# Altium project AX5043_module.PrjPcb
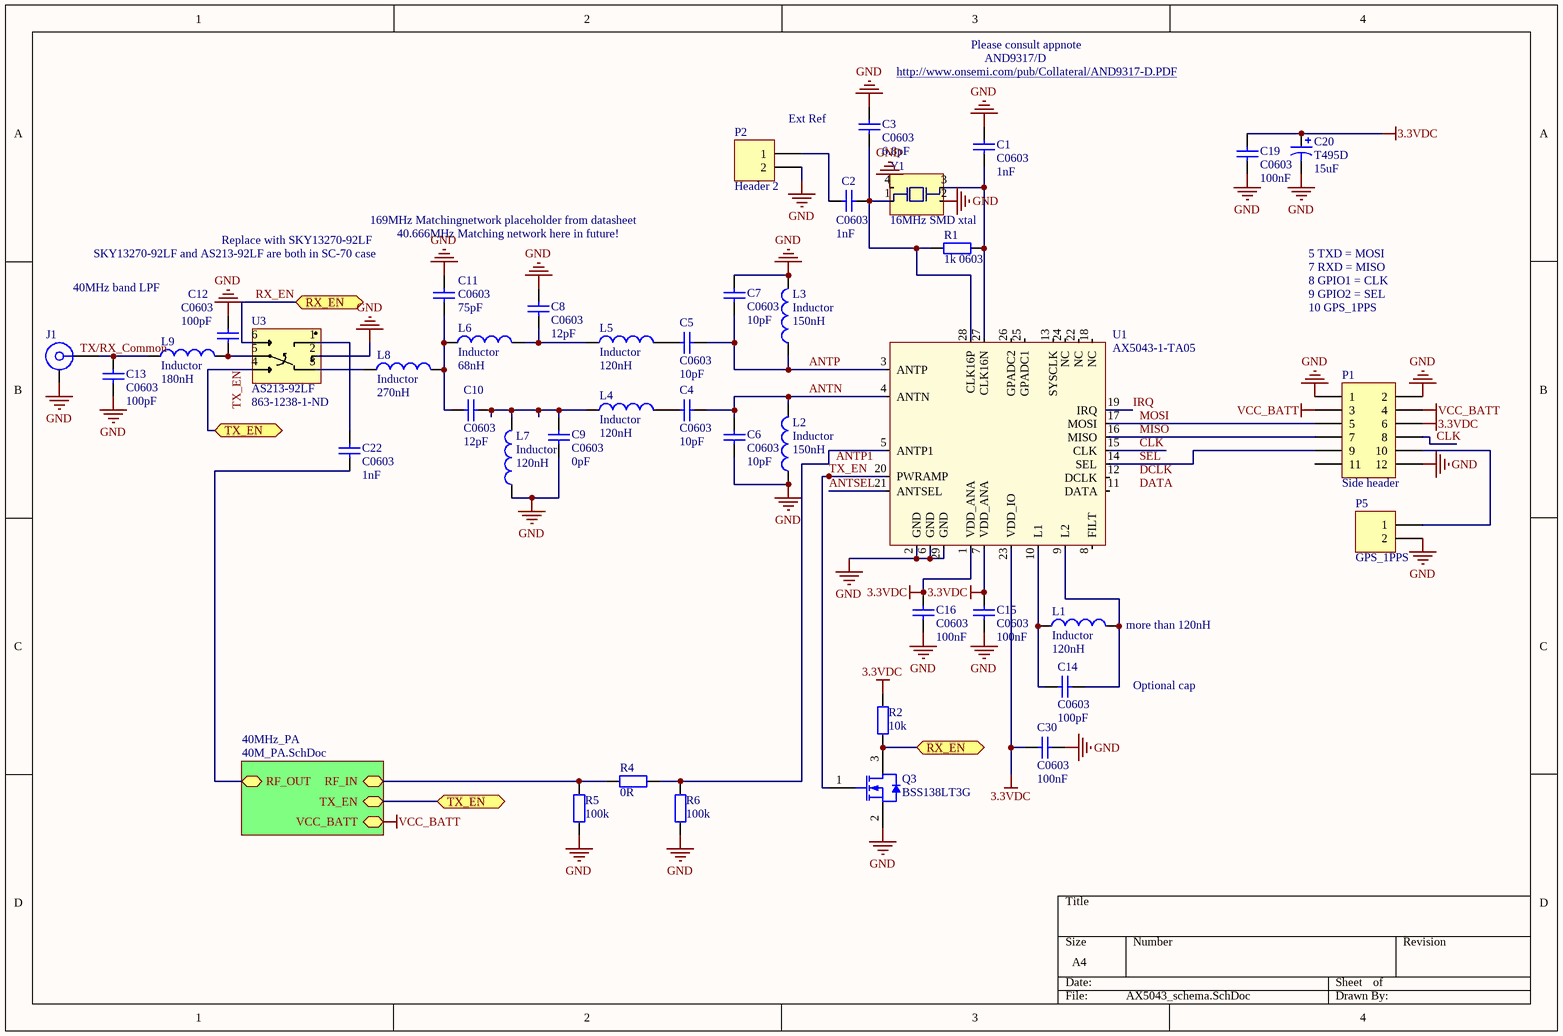
[diagram p0: AX5043_schema.SchDoc]
2 sheets, 59 parts. Net scope: hierarchical (ports join the sheet entries above them; power ports are global).
Board file: AX5043_module_pcb.PcbDoc
Sheets:
  AX5043_schema.SchDoc
    40MHz_PA = 40M_PA.SchDoc

## Sheet AX5043_schema.SchDoc: AX5243 40MHz Module
size A4; Date: 24.10.2017; DrawnBy: iv; Organization: FTG Heavy Industries; Revision: 0; SheetNumber: 1; SheetTotal: 1; DocumentName: AX5243 40MHz transceiver module main sheet; ProjectName: AX5243Module

### Parts
C1  C0603  value 1nF  [0603]
C2  C0603  value 1nF  [0603]
C3  C0603  value 6.8pF  [0603]
C4  C0603  value 10pF  [0603]
C5  C0603  value 10pF  [0603]
C6  C0603  value 10pF  [0603]
C7  C0603  value 10pF  [0603]
C8  C0603  value 12pF  [0603]
C9  C0603  value 0pF  [0603]
C10  C0603  value 12pF  [0603]
C11  C0603  value 75pF  [0603]
C12  C0603  value 100pF  [0603]
C13  C0603  value 100pF  [0603]
C14  C0603  value 100pF  [0603]
C15  C0603  value 100nF  [0603]
C16  C0603  value 100nF  [0603]
C19  C0603  value 100nF  [0603]
C20  T495D  value 15uF  [D]
C22  C0603  value 1nF  [0603]
C30  C0603  value 100nF  [0603]
J1  32K145-400L5  [ROS-32K145-400L5_V]  (value not drawn)
L1  Inductor  value 120nH  [INDC1608L]
L2  Inductor  value 150nH  [INDC1608L]
L3  Inductor  value 150nH  [INDC1608L]
L4  Inductor  value 120nH  [INDC1608L]
L5  Inductor  value 120nH  [INDC1608L]
L6  Inductor  value 68nH  [INDC1608L]
L7  Inductor  value 120nH  [INDC1608L]
L8  Inductor  value 270nH  [INDC1608L]
L9  Inductor  value 180nH  [INDC1608L]
P1  Side header  [HDR2X6H]
P2  Header 2  [HDR1X2]
P5  GPS_1PPS  [HDR1X2]
Q3  BSS138LT3G  [ONSC-SOT-23-3-318-08_V]
R1  1k 0603  [R0603]
R2  10k  [R0603]
R4  0R  [R0603]
R5  100k  [R0603]
R6  100k  [R0603]
U1  AX5043-1-TA05  [QFN50P500X500X85_HS-29M]
U3  AS213-92LF  Supplier Part Number 1: 863-1238-1-ND  [SC70_6]
Y1  16MHz SMD xtal  [FA-238]

### Sub-sheets
40MHz_PA = 40M_PA.SchDoc: RF_IN, RF_OUT, TX_EN, VCC_BATT

### Ports
RX_EN, TX_EN

### Nets
3.3VDC: C15.2 C16.2 C19.2 C20.1 C30.1 P1.6 R2.2 U1.1(VDD_ANA) U1.7(VDD_ANA) U1.23(VDD_IO)
GND: C1.2 C3.2 C6.1 C7.2 C8.1 C9.2 C11.1 C12.1 C13.1 C15.1 C16.1 C19.1 C20.2 C30.2 J1.MP L2.1 L3.2 L7.1 P1.1 P1.2 P1.12 P2.2 P5.2 Q3.2(S) R5.1 R6.1 U1.2(GND) U1.6(GND) U1.29(GND) U3.2 Y1.2 Y1.4
VCC_BATT: P1.3 P1.4 ; sheet 40MHz_PA/VCC_BATT
ANTN: C4.2 C6.2 L2.2 U1.4(ANTN)
ANTP: C5.2 C7.1 L3.1 U1.3(ANTP)
ANTSEL: U1.21(ANTSEL)
CLK: P1.8 U1.15(CLK)
IRQ: U1.19(IRQ)
MISO: P1.7 U1.16(MISO)
MOSI: P1.5 U1.17(MOSI)
RX_EN: Q3.3(D) R2.1 U3.6 ; port RX_EN
SEL: P1.9 U1.14(SEL)
TX_EN: Q3.1(G) U1.20(PWRAMP) U3.4 ; port TX_EN, sheet 40MHz_PA/TX_EN
NetC1_1: C1.1 R1.2 U1.27(CLK16N) Y1.3
NetC2_1: C2.1 C3.1 R1.1 U1.28(CLK16P) Y1.1
NetC2_2: C2.2 P2.1
NetC4_1: C4.1 L4.2
NetC5_1: C5.1 L5.2
NetC8_2: C8.2 L5.1 L6.2
NetC9_1: C9.1 C10.2 L4.1 L7.2
NetC10_1: C10.1 C11.2 L6.1 L8.2
NetC12_2: C12.2 L9.2 U3.5
NetC13_2: C13.2 J1.1 L9.1
NetC14_1: C14.1 L1.1 U1.10(L1)
NetC14_2: C14.2 L1.2 U1.9(L2)
NetC22_1: C22.1 ; sheet 40MHz_PA/RF_OUT
NetC22_2: C22.2 U3.1
NetC23_2: R4.2 R5.2 ; sheet 40MHz_PA/RF_IN
NetL8_1: L8.1 U3.3
NetP1_10: P1.10 P5.1
NetR4_1: R4.1 R6.2 U1.5(ANTP1)

Not connected (* = marked no-connect by the designer): P1 11; U1 8(FILT) 11(DATA) 12(DCLK) 13(SYSCLK) 18(NC) 22(NC) 24(NC) 25(GPADC1) 26(GPADC2)

### Notes on the sheet
- http://www.onsemi.com/pub/Collateral/AND9317-D.PDF
- Please consult appnote
- AND9317/D
- Ext Ref
- Replace with SKY13270-92LF
- 169MHz Matchingnetwork placeholder from datasheet
- 40.666MHz Matching network here in future!
- 40MHz band LPF
- SKY13270-92LF and AS213-92LF are both in SC-70 case
- 5 TXD = MOSI
- 7 RXD = MISO
- 8 GPIO1 = CLK
- 9 GPIO2 = SEL
- 10 GPS_1PPS
- (near L1) more than 120nH
- Optional cap
- Labels drawn without touching a wire or pin: ANTP1, DATA, DCLK, TX/RX_Common

### Library data of the parts
C1-C16 C19 C22 C30 = C0603: Ceramic Chip Capacitor - Standard; Note: Footprint corresponds to dimensions for bulk cassette packaging. This case size has tightened tolerances.; Published: 17-Jul-2002; LatestRevisionDate: 19-Mar-2004; LatestRevisionNote: Silkscreen size reduced.; DatasheetDocument: Mar-2001; PackageDocument: Mar-2001; PackageReference: 0603; Publisher: Altium Limited; Code_JEITA: 0603; Code_IPC: 1608 [0603]; ComponentLink1Description: Manufacturer Link; ComponentLink1URL: http://www.kemet.com/; ComponentLink2Description: Datasheet; ComponentLink2URL: http://www.kemet.com/kemet/web/homepage/kechome.nsf/vapubfilesname/F3102TA.pdf/$file/F3102TA.pdf
C20 = T495D: Solid Tantalum Chip Capacitor, Standard T495 Series - Low ESR, Surge Robust; Published: 17-Jul-2002; LatestRevisionDate: 19-Mar-2004; LatestRevisionNote: Silkscreen dimensions re-sized.; DatasheetDocument: Mar-2001; PackageDocument: Mar-2001; PackageReference: D; Publisher: Altium Limited; Code_JEITA: 7343-31; ComponentLink1Description: Manufacturer Link; ComponentLink1URL: http://www.kemet.com/; ComponentLink2Description: Datasheet; ComponentLink2URL: http://www.kemet.com/kemet/web/homepage/kechome.nsf/vapubfilesname/F3102TA.pdf/$file/F3102TA.pdf
J1 = 32K145-400L5: SMA Right Angle Jack, Edge Mount, Up to 18 GHz, -55 to 155 degC; Design Note 1: Footprint in library is a generic example - only application specific footprint delivers High Performance; Desgin Note 2: For more information about DRC setting, please look at following webpage, http://techdocs.altium.com/display/SCRT/Design+Rule+for+Edge-Mount+Connectors; DatasheetVersion: b00; PackageVersion: b00; PackageReference: 32K145-400L5; PackageDescription: SMA Right Angle Jack, Edge Mount, 14.25 x 9.5 x 4.46 mm; Mounting Technology: Surface Mount; PartNumber: 32K145-400L5; ComponentLink1Description: Manufacturer URL; ComponentLink1URL: http://www.rosenberger.de; ComponentLink2Description: Datasheet; ComponentLink2URL: http://rosenberger.de/ok/images/documents/db/32K145-400L5.pdf; ComponentLink3Description: Package Specification; ComponentLink3URL: http://rosenberger.de/ok/images/documents/db/32K145-400L5.pdf; ComponentLink4Description: Series Overview / Design Note; ComponentLink4URL: http://rosenberger.de/ok/images/documents/spez/32.pdf; ComponentLink5Description: Webshop / RFQ; ComponentLink5URL: http://www.rosenberger.com/en/contact/sales/
L1-L9 = Inductor: Code_IEC: 1005; Published: 8-Jun-2000; LatestRevisionDate: 29-May-2009; LatestRevisionNote: IPC-7351 Footprint Added.; PackageReference: 0402-A; Publisher: Altium Limited; PackageDescription: Chip Inductor; Code_JEITA: 0402
P1 = Header 6X2H: Header, 6-Pin, Dual row, Right Angle; LatestRevisionDate: 17-Jul-2002; LatestRevisionNote: Re-released for DXP Platform.; Publisher: Altium Limited
P2 P5 = Header 2: Header, 2-Pin; LatestRevisionDate: 17-Jul-2002; LatestRevisionNote: Re-released for DXP Platform.; Publisher: Altium Limited
Q3 = CMP-1058-00765-1: Power MOSFET, 200 mA, 50 V, N-Channel, 3-Pin SOT-23, Pb-Free, Tape and Reel; Manufacturer: On Semiconductor; PD Max (W): 0.225; Channel Polarity: N Channel; Crss Typ (pF): 3.5; Configuration: Single; ID Max (A): 0.2; Ciss Typ (pF): 40; V(BR)DSS Min (V): 50; VGS(th) Max (V): 1.5; Coss Typ (pF): 12; VGS Max (V): 20; ComponentLink2URL: http://www.onsemi.com/pub_link/Collateral/BSS138LT1-D.PDF; PackageDescription: 3-Pin Small Outline Transistor, Body 2.92 x 1.3 mm, Pitch 0.95 mm; Package Type: SOT-23-3; Mounting Technology: Surface Mount; ComponentLink1Description: Manufacturer URL; PackageVersion: Rev. AP, 11/2009; ComponentLink3Description: Package Specification; DatasheetVersion: Rev. 8; RoHS: Pb-Free; Packing: Tape and Reel; PackageReference: SOT-23-3-318-08; PartNumber: BSS138LT3G; ComponentLink3URL: http://www.onsemi.cn/pub_link/Collateral/318-08.PDF; ComponentLink1URL: http://www.onsemi.com/; ComponentLink2Description: Datasheet
R2 R4-R6 = 1k 0603
U1 = AX5043: Data Tranceiver 27-1050MHz Separate TX/RX ports; Manufacturer: ON Semiconductor; Frequency: 27MHz; Data Rate: 125Kbps; Sensitivity: -137dBm; Max Frequency: 1.05GHz; Min Supply Voltage: 1.8V; Max Supply Voltage: 3.6V; Interface: SPI,UART; Current - Receiving: 11mA; Current - Transmitting: 48mA; Supplier 1: Mouser; Manufacturer Part Number: AX5043-1-TA05; Stock 1: 3949; Mount: Surface Mount; Case/Package: QFN; Number of Pins: 28; Min Operating Temperature: -40°C; Max Operating Temperature: 85°C; Packaging: Tape and Reel; REACH SVHC: No SVHC; Lead Free: Lead Free; ComponentLink1URL: http://www.mouser.com/ds/2/308/AX5043-D-782042.pdf; ComponentLink1Description: http://www.mouser.com/ds/2/308/AX5043-D-782042.pdf; ComponentLink2URL: http://www.onsemi.com/pub_link/Collateral/AX5043-D.PDF; ComponentLink2Description: http://www.onsemi.com/pub_link/Collateral/AX5043-D.PDF; ComponentLink3URL: http://www.farnell.com/datasheets/2009298.pdf; ComponentLink3Description: http://www.farnell.com/datasheets/2009298.pdf; ComponentLink4URL: http://www.onsemi.com/pub/Collateral/AX5043-D.PDF; ComponentLink4Description: http://www.onsemi.com/pub/Collateral/AX5043-D.PDF
U3 = AS213-92LF: Switch SPDT 0.1-3GHZ GAAS SC70-6; Manufacturer 1: Skyworks Solutions Inc.; Frequency - Lower: 100MHz; Frequency - Upper: 3GHz; Isolation @ Frequency: 19dB @ 3GHz (typ); Insertion Loss @ Frequency: 0.5dB @ 3GHz; IIP3: 40dBm (typ); Topology: Reflective; P1dB: 27dBm (typ) IP1dB; Impedance: 50 Ohm; Voltage - Supply: 3V; RF Type: Bluetooth, WLAN; Supplier 1: Digi-Key; Manufacturer Part Number 1: AS213-92LF; RoHS: RoHS Compliant; Category: RF/IF and RFID; Stock 1: 26253; Pricing 1: 1=0.41, 100=0.3393 (EUR); Packaging: Cut Tape (CT); Circuit: SPDT; Features: -; Operating Temperature: -40°C ~ 85°C; Package / Case: 6-TSSOP, SC-88, SOT-363; Supplier Device Package: SC-70-6; ComponentLink1URL: http://www.skyworksinc.com/uploads/documents/200193D.pdf; ComponentLink1Description: http://www.skyworksinc.com/uploads/documents/200193D.pdf
Y1 = FA-238_16.0000MB-C3: 16MHz SMD xtal 3.20mm x 2.50mm; Manufacturer: Epson; Manufacturer Part Number: FA-23816.0000MB-C3; Tolerance: 50ppm; Load Capacitance: 18pF; ESR (Equivalent Series Resistance): 80R; Frequency Stability: 30ppm; Supplier 1: Digi-Key; Stock 1: 19537; Mount: Surface Mount; Case/Package: SMD/SMT; Weight: 0.000564oz; Min Operating Temperature: -20°C; Max Operating Temperature: 70°C; Packaging: Tape and Reel; Package Quantity: 250; Frequency: 16MHz; Frequency Tolerance: 50ppm; Termination: SMD/SMT; Length: 0.126inch; Height: 0.028inch; Width: 0.098inch; Lead Free: Lead Free; ComponentLink1URL: http://www.eea.epson.com/portal/pls/portal/docs/1/1531444.PDF; ComponentLink1Description: http://www.eea.epson.com/portal/pls/portal/docs/1/1531444.PDF; ComponentLink2URL: http://www.mouser.com/ds/2/137/A-238_en-932914.pdf; ComponentLink2Description: http://www.mouser.com/ds/2/137/A-238_en-932914.pdf; Supplier Part Number 1: SER3686CT-ND

## Sheet 40M_PA.SchDoc: AX5243 40MHz Module
size A4; Date: 24.10.2017; DrawnBy: iv; Organization: FTG Heavy Industries; Revision: 0; SheetNumber: 1; SheetTotal: 1; DocumentName: AX5243 40MHz transceiver module main sheet; ProjectName: AX5243Module
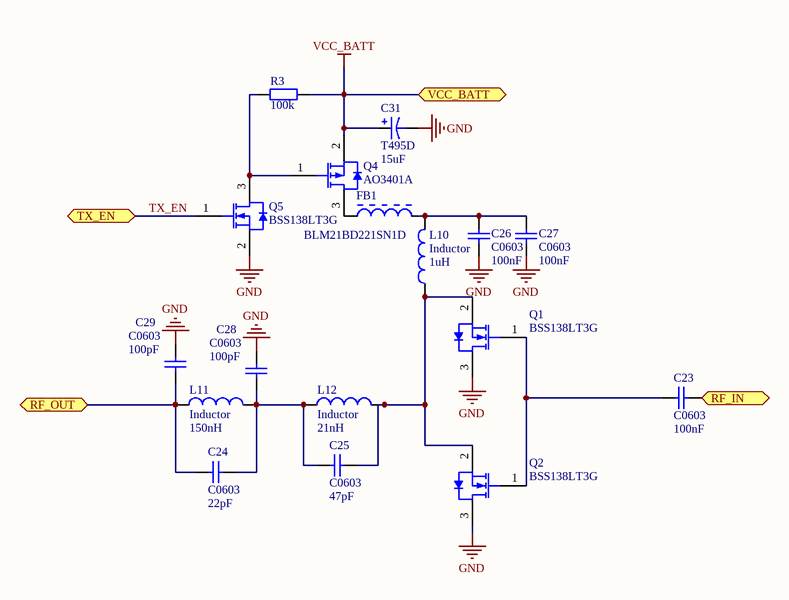
[diagram p1: 40M_PA.SchDoc]

### Parts
C23  C0603  value 100nF  [0603]
C24  C0603  value 22pF  [0603]
C25  C0603  value 47pF  [0603]
C26  C0603  value 100nF  [0603]
C27  C0603  value 100nF  [0603]
C28  C0603  value 100pF  [0603]
C29  C0603  value 100pF  [0603]
C31  T495D  value 15uF  [D]
FB1  BLM21BD221SN1D  [MURA-BLM21-H1-CHIP-2_V]
L10  Inductor  value 1uH  [INDC1608L]
L11  Inductor  value 150nH  [INDC1608L]
L12  Inductor  value 21nH  [INDC1608L]
Q1  BSS138LT3G  [ONSC-SOT-23-3-318-08_V]
Q2  BSS138LT3G  [ONSC-SOT-23-3-318-08_V]
Q4  AO3401A  [AO-SOT-23-3L_V]
Q5  BSS138LT3G  [ONSC-SOT-23-3-318-08_V]
R3  100k  [R0603]

### Ports
RF_IN, RF_OUT, TX_EN, VCC_BATT

### Nets
GND: C26.2 C27.2 C28.1 C29.1 C31.2 Q1.3(D) Q2.3(D) Q5.2(S)
VCC_BATT: C31.1 Q4.2(SOURCE) R3.2 ; port VCC_BATT
TX_EN: Q5.1(G) ; port TX_EN
NetC22_1: C24.1 C29.2 L11.1 ; port RF_OUT
NetC23_1: C23.1 Q1.1(G) Q2.1(G)
NetC23_2: C23.2 ; port RF_IN
NetC24_2: C24.2 C25.1 C28.2 L11.2 L12.1
NetC25_2: C25.2 L10.1 L12.2 Q1.2(S) Q2.2(S)
NetC26_1: C26.1 C27.1 FB1.2 L10.2
NetFB1_1: FB1.1 Q4.3(DRAIN)
NetQ4_1: Q4.1(GATE) Q5.3(D) R3.1

### Library data of the parts
C23-C29 = C0603: as C1 on sheet AX5043_schema; Published: 17-Jul-2002; LatestRevisionDate: 19-Mar-2004; LatestRevisionNote: Silkscreen size reduced.; DatasheetDocument: Mar-2001; PackageDocument: Mar-2001; PackageReference: 0603; Publisher: Altium Limited; Code_JEITA: 0603; Code_IPC: 1608 [0603]; ComponentLink1Description: Manufacturer Link; ComponentLink1URL: http://www.kemet.com/; ComponentLink2Description: Datasheet; ComponentLink2URL: http://www.kemet.com/kemet/web/homepage/kechome.nsf/vapubfilesname/F3102TA.pdf/$file/F3102TA.pdf
C31 = T495D: as C20 on sheet AX5043_schema; Published: 17-Jul-2002; LatestRevisionDate: 19-Mar-2004; LatestRevisionNote: Silkscreen dimensions re-sized.; DatasheetDocument: Mar-2001; PackageDocument: Mar-2001; PackageReference: D; Publisher: Altium Limited; Code_JEITA: 7343-31; ComponentLink1Description: Manufacturer Link; ComponentLink1URL: http://www.kemet.com/; ComponentLink2Description: Datasheet; ComponentLink2URL: http://www.kemet.com/kemet/web/homepage/kechome.nsf/vapubfilesname/F3102TA.pdf/$file/F3102TA.pdf
FB1 = CMP-0686-00656-2: Chip Ferrite Bead for High Speed Signal lines, 220 Ohm, 200 mA, -55 to 125 degC, 2 x 1.25 x 1.05 mm SMD, Tape and Reel; Manufacturer: Murata; Rated Current: 200 mA; Impedance (at 100 MHz): 220 Ohm +/- 25%; DC Resistance: 0.25 Ohm Max.; PackageDescription: 2-Pin Chip, Body 2 x 1.25 mm; Operating Temperature Range: -55 to 125 degC; ComponentLink3Description: Package Specification; ComponentLink2URL: http://www.murata.com/products/catalog/pdf/c31e.pdf; DatasheetVersion: 08/2013; PackageReference: BLM21_H1050-2; Packing: Tape and Reel; ComponentLink1Description: Manufacturer URL; ComponentLink3URL: http://www.murata.com/products/catalog/pdf/c31e.pdf; PartNumber: BLM21BD221SN1D; ComponentLink1URL: http://www.murata.com/; ComponentLink2Description: Datasheet; Mounting Technology: Surface Mount
L10-L12 = Inductor: Code_IEC: 1005; Published: 8-Jun-2000; LatestRevisionDate: 29-May-2009; LatestRevisionNote: IPC-7351 Footprint Added.; PackageReference: 0402-A; Publisher: Altium Limited; PackageDescription: Chip Inductor; Code_JEITA: 0402
Q1 Q2 Q5 = CMP-1058-00765-1: as Q3 on sheet AX5043_schema; ComponentLink2URL: http://www.onsemi.com/pub_link/Collateral/BSS138LT1-D.PDF; PackageDescription: 3-Pin Small Outline Transistor, Body 2.92 x 1.3 mm, Pitch 0.95 mm; Package Type: SOT-23-3; Mounting Technology: Surface Mount; ComponentLink1Description: Manufacturer URL; PackageVersion: Rev. AP, 11/2009; ComponentLink3Description: Package Specification; DatasheetVersion: Rev. 8; RoHS: Pb-Free; Packing: Tape and Reel; PackageReference: SOT-23-3-318-08; PartNumber: BSS138LT3G; ComponentLink3URL: http://www.onsemi.cn/pub_link/Collateral/318-08.PDF; ComponentLink1URL: http://www.onsemi.com/; ComponentLink2Description: Datasheet
Q4 = CMP-2000-05778-1: P-Channel MOSFET, 30 V, 4 A, -55 to 150 degC, 3-Pin SOT-23-3L, RoHS, Tape and Reel; Manufacturer: Alpha and Omega; Output Power (Max): NotRequiredW; Power Dissipation: 1.4W; Rad Hardened: No; Drain Efficiency: NotRequired%; Drain-Source On-Volt: 30V; Noise Figure: NotRequireddB; Frequency (Max): NotRequiredMHz; Number of  Elements: 1; Gate-Source Voltage (Max): ?12V; Drain Current (Max): 4A; Channel Mode: Enhancement; Drain-Source On-Res: 0.044ohm; Type: PowerMOSFET; Polarity: P; Package URL: http://www.aosmd.com/res/packaging_information/SOT-23-3L.pdf; Datasheet URL: http://www.aosmd.com/res/data_sheets/AO3401A.pdf; Package Type: SOT-23; Package Description: 3-Pin Small Outline Transistor, Body 2.95 x 1.6 mm, Pitch 0.95 mm; Mounting: SurfaceMount; Manufacturer URL: http://www.aosmd.com/; Continuous Drain Current: 4A; Package Reference: SOT-23-3L; Mounting Technology: SurfaceMount; Operating Temperature Classification: Military; Power Gain: NotRequireddB; Datasheet Version: Rev. 3, 03/2011; Operating Temp Range: -55Cto150C; Pin Count: 3
R3 = 1k 0603

## Nets that join several sheets
GND: AX5043_schema (32 pins), 40M_PA (8 pins)
VCC_BATT: AX5043_schema (P1.3 P1.4), 40M_PA (C31.1 Q4.2 R3.2)
NetC22_1: AX5043_schema (C22.1), 40M_PA (C24.1 C29.2 L11.1)
NetC23_2: AX5043_schema (R4.2 R5.2), 40M_PA (C23.2)
TX_EN: AX5043_schema (Q3.1 U1.20 U3.4), 40M_PA (Q5.1)